# Altium schematic sheet BMS AFE - Cell Balancing.SchDoc: Title
size B; Organization: Midnight Sun Solar Rayce Car Team; Address1: University of Waterloo; Address2: 200 University Ave W; Address3: Waterloo, ON, Canada; Address4: N2L 3E9; DocumentNumber: 4; SheetNumber: 4; SheetTotal: 7; Website: www.uwmidsun.com; ProjectName: ProjectName
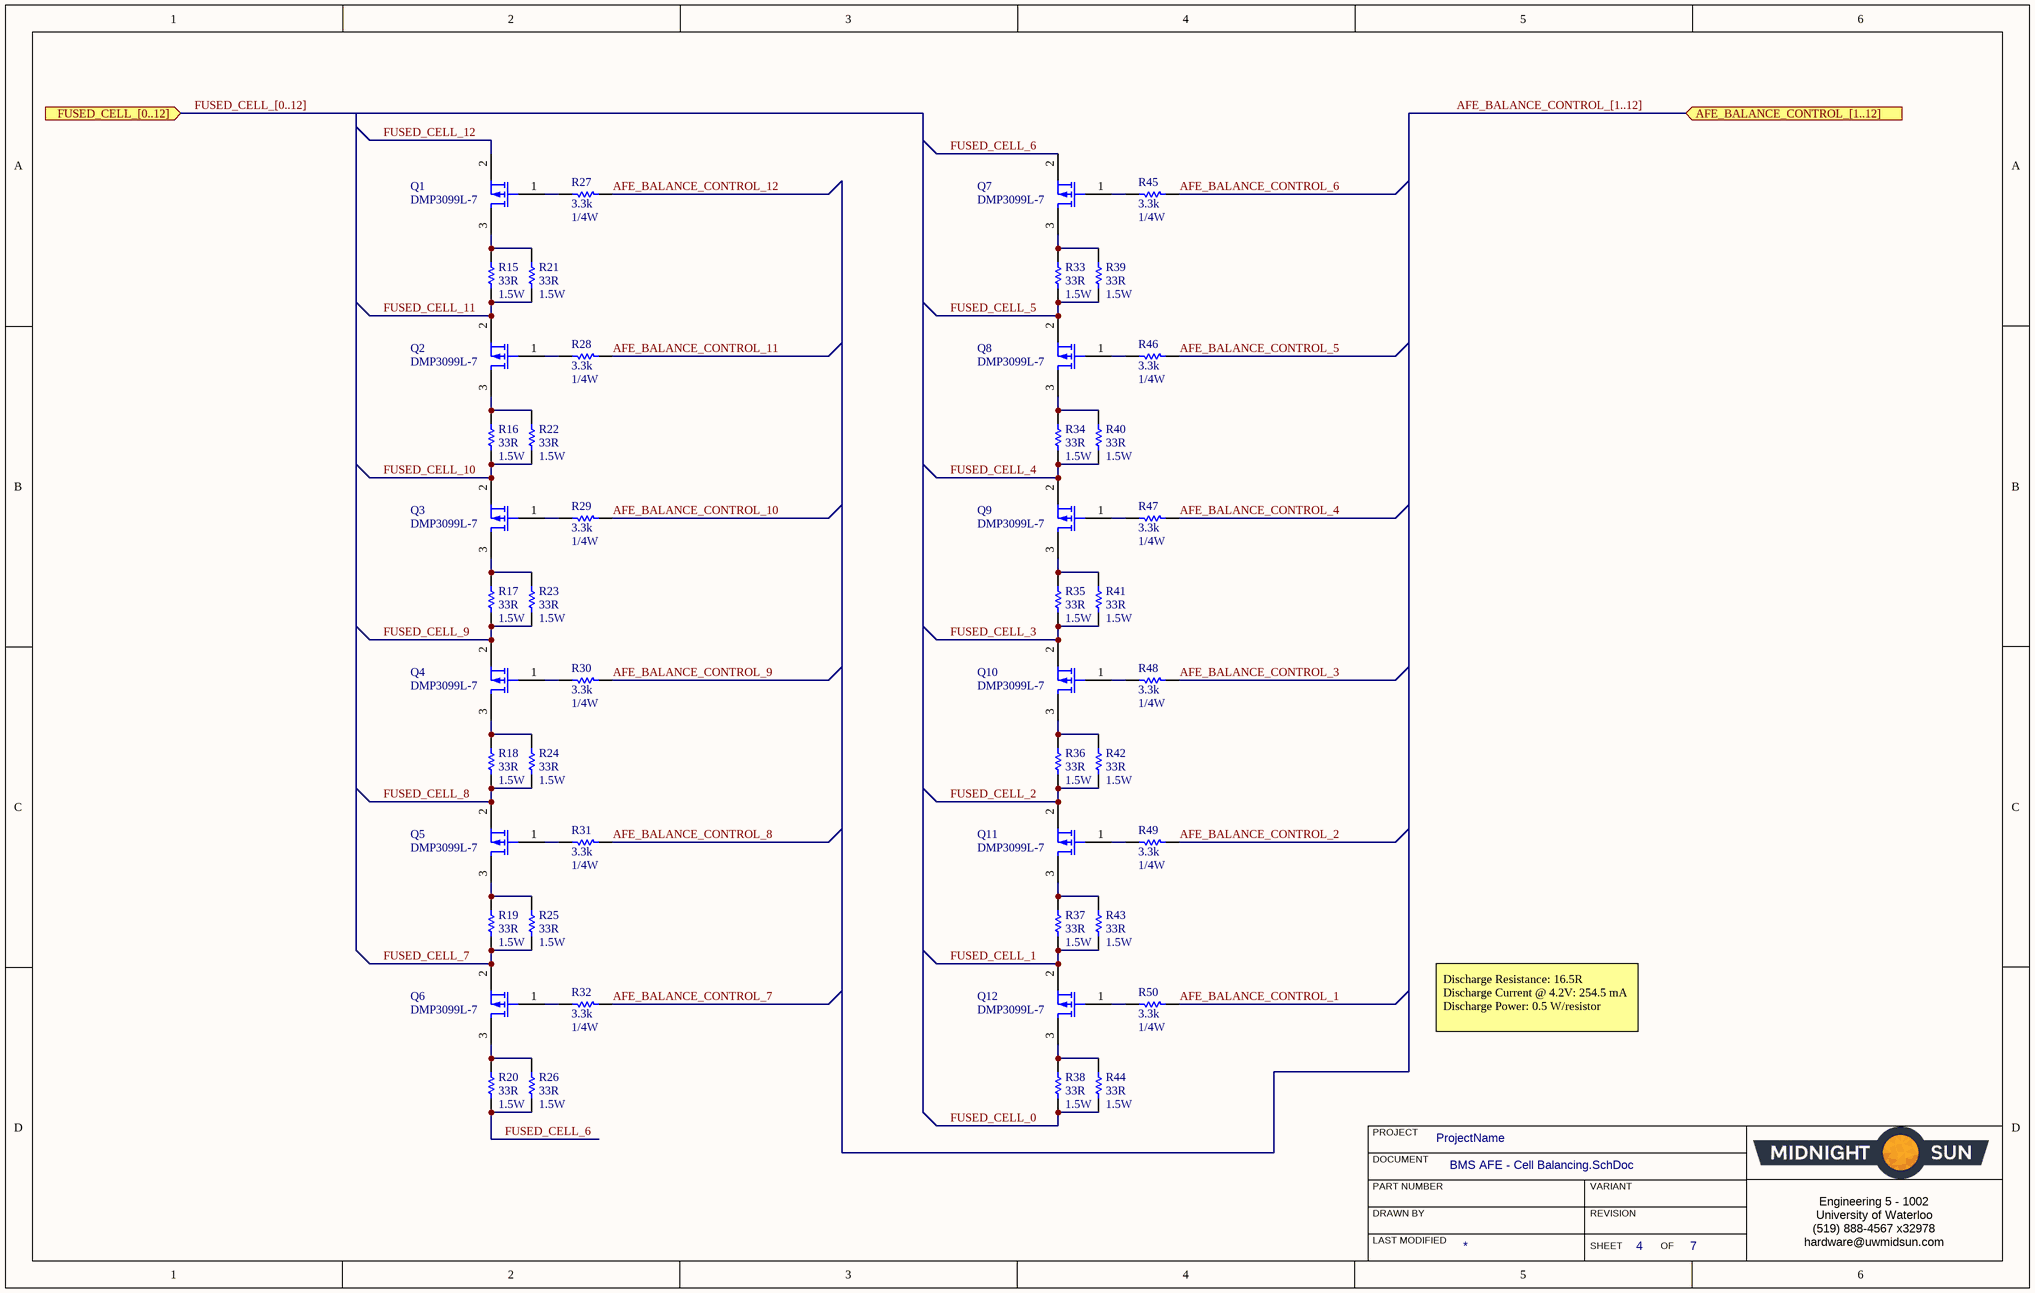
[diagram p0: BMS AFE - Cell Balancing.SchDoc]

## Parts
Q1  Manufacturer Part Number: DMP3099L-7  [MOSFET P-CH 30V 3.8A SOT-23]  (hidden comment: MOSFET P-CH 30V 3.8A SOT-23)
Q2  Manufacturer Part Number: DMP3099L-7  [MOSFET P-CH 30V 3.8A SOT-23]  (hidden comment: MOSFET P-CH 30V 3.8A SOT-23)
Q3  Manufacturer Part Number: DMP3099L-7  [MOSFET P-CH 30V 3.8A SOT-23]  (hidden comment: MOSFET P-CH 30V 3.8A SOT-23)
Q4  Manufacturer Part Number: DMP3099L-7  [MOSFET P-CH 30V 3.8A SOT-23]  (hidden comment: MOSFET P-CH 30V 3.8A SOT-23)
Q5  Manufacturer Part Number: DMP3099L-7  [MOSFET P-CH 30V 3.8A SOT-23]  (hidden comment: MOSFET P-CH 30V 3.8A SOT-23)
Q6  Manufacturer Part Number: DMP3099L-7  [MOSFET P-CH 30V 3.8A SOT-23]  (hidden comment: MOSFET P-CH 30V 3.8A SOT-23)
Q7  Manufacturer Part Number: DMP3099L-7  [MOSFET P-CH 30V 3.8A SOT-23]  (hidden comment: MOSFET P-CH 30V 3.8A SOT-23)
Q8  Manufacturer Part Number: DMP3099L-7  [MOSFET P-CH 30V 3.8A SOT-23]  (hidden comment: MOSFET P-CH 30V 3.8A SOT-23)
Q9  Manufacturer Part Number: DMP3099L-7  [MOSFET P-CH 30V 3.8A SOT-23]  (hidden comment: MOSFET P-CH 30V 3.8A SOT-23)
Q10  Manufacturer Part Number: DMP3099L-7  [MOSFET P-CH 30V 3.8A SOT-23]  (hidden comment: MOSFET P-CH 30V 3.8A SOT-23)
Q11  Manufacturer Part Number: DMP3099L-7  [MOSFET P-CH 30V 3.8A SOT-23]  (hidden comment: MOSFET P-CH 30V 3.8A SOT-23)
Q12  Manufacturer Part Number: DMP3099L-7  [MOSFET P-CH 30V 3.8A SOT-23]  (hidden comment: MOSFET P-CH 30V 3.8A SOT-23)
R15  value 33R  Power (Watts): 1.5W  [RES STACKPOLE RPC2512 2512]  (hidden comment: RES 33 OHM 5% 1.5W 2512)
R16  value 33R  Power (Watts): 1.5W  [RES STACKPOLE RPC2512 2512]  (hidden comment: RES 33 OHM 5% 1.5W 2512)
R17  value 33R  Power (Watts): 1.5W  [RES STACKPOLE RPC2512 2512]  (hidden comment: RES 33 OHM 5% 1.5W 2512)
R18  value 33R  Power (Watts): 1.5W  [RES STACKPOLE RPC2512 2512]  (hidden comment: RES 33 OHM 5% 1.5W 2512)
R19  value 33R  Power (Watts): 1.5W  [RES STACKPOLE RPC2512 2512]  (hidden comment: RES 33 OHM 5% 1.5W 2512)
R20  value 33R  Power (Watts): 1.5W  [RES STACKPOLE RPC2512 2512]  (hidden comment: RES 33 OHM 5% 1.5W 2512)
R21  value 33R  Power (Watts): 1.5W  [RES STACKPOLE RPC2512 2512]  (hidden comment: RES 33 OHM 5% 1.5W 2512)
R22  value 33R  Power (Watts): 1.5W  [RES STACKPOLE RPC2512 2512]  (hidden comment: RES 33 OHM 5% 1.5W 2512)
R23  value 33R  Power (Watts): 1.5W  [RES STACKPOLE RPC2512 2512]  (hidden comment: RES 33 OHM 5% 1.5W 2512)
R24  value 33R  Power (Watts): 1.5W  [RES STACKPOLE RPC2512 2512]  (hidden comment: RES 33 OHM 5% 1.5W 2512)
R25  value 33R  Power (Watts): 1.5W  [RES STACKPOLE RPC2512 2512]  (hidden comment: RES 33 OHM 5% 1.5W 2512)
R26  value 33R  Power (Watts): 1.5W  [RES STACKPOLE RPC2512 2512]  (hidden comment: RES 33 OHM 5% 1.5W 2512)
R27  Resistance: 3.3k  Power: 1/4W  [RES, 0603]  (hidden comment: RES 3.3K OHM 1% 1/4W 0603)
R28  Resistance: 3.3k  Power: 1/4W  [RES, 0603]  (hidden comment: RES 3.3K OHM 1% 1/4W 0603)
R29  Resistance: 3.3k  Power: 1/4W  [RES, 0603]  (hidden comment: RES 3.3K OHM 1% 1/4W 0603)
R30  Resistance: 3.3k  Power: 1/4W  [RES, 0603]  (hidden comment: RES 3.3K OHM 1% 1/4W 0603)
R31  Resistance: 3.3k  Power: 1/4W  [RES, 0603]  (hidden comment: RES 3.3K OHM 1% 1/4W 0603)
R32  Resistance: 3.3k  Power: 1/4W  [RES, 0603]  (hidden comment: RES 3.3K OHM 1% 1/4W 0603)
R33  value 33R  Power (Watts): 1.5W  [RES STACKPOLE RPC2512 2512]  (hidden comment: RES 33 OHM 5% 1.5W 2512)
R34  value 33R  Power (Watts): 1.5W  [RES STACKPOLE RPC2512 2512]  (hidden comment: RES 33 OHM 5% 1.5W 2512)
R35  value 33R  Power (Watts): 1.5W  [RES STACKPOLE RPC2512 2512]  (hidden comment: RES 33 OHM 5% 1.5W 2512)
R36  value 33R  Power (Watts): 1.5W  [RES STACKPOLE RPC2512 2512]  (hidden comment: RES 33 OHM 5% 1.5W 2512)
R37  value 33R  Power (Watts): 1.5W  [RES STACKPOLE RPC2512 2512]  (hidden comment: RES 33 OHM 5% 1.5W 2512)
R38  value 33R  Power (Watts): 1.5W  [RES STACKPOLE RPC2512 2512]  (hidden comment: RES 33 OHM 5% 1.5W 2512)
R39  value 33R  Power (Watts): 1.5W  [RES STACKPOLE RPC2512 2512]  (hidden comment: RES 33 OHM 5% 1.5W 2512)
R40  value 33R  Power (Watts): 1.5W  [RES STACKPOLE RPC2512 2512]  (hidden comment: RES 33 OHM 5% 1.5W 2512)
R41  value 33R  Power (Watts): 1.5W  [RES STACKPOLE RPC2512 2512]  (hidden comment: RES 33 OHM 5% 1.5W 2512)
R42  value 33R  Power (Watts): 1.5W  [RES STACKPOLE RPC2512 2512]  (hidden comment: RES 33 OHM 5% 1.5W 2512)
R43  value 33R  Power (Watts): 1.5W  [RES STACKPOLE RPC2512 2512]  (hidden comment: RES 33 OHM 5% 1.5W 2512)
R44  value 33R  Power (Watts): 1.5W  [RES STACKPOLE RPC2512 2512]  (hidden comment: RES 33 OHM 5% 1.5W 2512)
R45  Resistance: 3.3k  Power: 1/4W  [RES, 0603]  (hidden comment: RES 3.3K OHM 1% 1/4W 0603)
R46  Resistance: 3.3k  Power: 1/4W  [RES, 0603]  (hidden comment: RES 3.3K OHM 1% 1/4W 0603)
R47  Resistance: 3.3k  Power: 1/4W  [RES, 0603]  (hidden comment: RES 3.3K OHM 1% 1/4W 0603)
R48  Resistance: 3.3k  Power: 1/4W  [RES, 0603]  (hidden comment: RES 3.3K OHM 1% 1/4W 0603)
R49  Resistance: 3.3k  Power: 1/4W  [RES, 0603]  (hidden comment: RES 3.3K OHM 1% 1/4W 0603)
R50  Resistance: 3.3k  Power: 1/4W  [RES, 0603]  (hidden comment: RES 3.3K OHM 1% 1/4W 0603)

## Ports
AFE_BALANCE_CONTROL_[1..12] (in), FUSED_CELL_[0..12] (in)

## Nets
AFE_BALANCE_CONTROL_1: R50.1
AFE_BALANCE_CONTROL_2: R49.1
AFE_BALANCE_CONTROL_3: R48.1
AFE_BALANCE_CONTROL_4: R47.1
AFE_BALANCE_CONTROL_5: R46.1
AFE_BALANCE_CONTROL_6: R45.1
AFE_BALANCE_CONTROL_7: R32.1
AFE_BALANCE_CONTROL_8: R31.1
AFE_BALANCE_CONTROL_9: R30.1
AFE_BALANCE_CONTROL_10: R29.1
AFE_BALANCE_CONTROL_11: R28.1
AFE_BALANCE_CONTROL_12: R27.1
FUSED_CELL_0: R38.2 R44.2
FUSED_CELL_1: Q12.2(S) R37.2 R43.2
FUSED_CELL_2: Q11.2(S) R36.2 R42.2
FUSED_CELL_3: Q10.2(S) R35.2 R41.2
FUSED_CELL_4: Q9.2(S) R34.2 R40.2
FUSED_CELL_5: Q8.2(S) R33.2 R39.2
FUSED_CELL_6: Q7.2(S) R20.2 R26.2
FUSED_CELL_7: Q6.2(S) R19.2 R25.2
FUSED_CELL_8: Q5.2(S) R18.2 R24.2
FUSED_CELL_9: Q4.2(S) R17.2 R23.2
FUSED_CELL_10: Q3.2(S) R16.2 R22.2
FUSED_CELL_11: Q2.2(S) R15.2 R21.2
FUSED_CELL_12: Q1.2(S)
NetQ1_1: Q1.1(G) R27.2
NetQ1_3: Q1.3(D) R15.1 R21.1
NetQ2_1: Q2.1(G) R28.2
NetQ2_3: Q2.3(D) R16.1 R22.1
NetQ3_1: Q3.1(G) R29.2
NetQ3_3: Q3.3(D) R17.1 R23.1
NetQ4_1: Q4.1(G) R30.2
NetQ4_3: Q4.3(D) R18.1 R24.1
NetQ5_1: Q5.1(G) R31.2
NetQ5_3: Q5.3(D) R19.1 R25.1
NetQ6_1: Q6.1(G) R32.2
NetQ6_3: Q6.3(D) R20.1 R26.1
NetQ7_1: Q7.1(G) R45.2
NetQ7_3: Q7.3(D) R33.1 R39.1
NetQ8_1: Q8.1(G) R46.2
NetQ8_3: Q8.3(D) R34.1 R40.1
NetQ9_1: Q9.1(G) R47.2
NetQ9_3: Q9.3(D) R35.1 R41.1
NetQ10_1: Q10.1(G) R48.2
NetQ10_3: Q10.3(D) R36.1 R42.1
NetQ11_1: Q11.1(G) R49.2
NetQ11_3: Q11.3(D) R37.1 R43.1
NetQ12_1: Q12.1(G) R50.2
NetQ12_3: Q12.3(D) R38.1 R44.1

## Buses and harness runs
bus AFE_BALANCE_CONTROL_[1..12] = port AFE_BALANCE_CONTROL_[1..12]
bus FUSED_CELL_[0..12] = port FUSED_CELL_[0..12]

## Notes on the sheet
- Discharge Resistance: 16.5R
  Discharge Current @ 4.2V: 254.5 mA
  Discharge Power: 0.5 W/resistor
- PROJECT
- DOCUMENT
- DRAWN BY
- LAST MODIFIED
- PART NUMBER
- REVISION
- SHEET
- VARIANT
- OF
- Engineering 5 - 1002
  University of Waterloo
  (519) 888-4567 x32978
  hardware@uwmidsun.com

## Library data of the parts
Q1-Q12 = MOSFET P-CH 30V 3.8A SOT-23: P-Channel 30V 3.8A (Ta) 1.08W (Ta) Surface Mount SOT-23; Manufacturer: Diodes Incorporated; Drive Voltage (Max Rds On,  Min Rds On): 4.5V, 10V; Rds On (Max) @ Id, Vgs: 65 mOhm @ 3.8A, 10V; Vgs(th) (Max) @ Id: 2.1V @ 250µA; Vgs (Max): ±20V; Supplier 1: Digi-Key; RoHS: RoHS Compliant; Category: Discrete Semiconductor Products; Stock 1: 108364; Pricing 1: 1=0.59, 10=0.429, 100=0.2522, 500=0.14282, 1000=0.10949 (CAD); Packaging: Cut Tape (CT); Part Status: Active; FET Type: P-Channel; Technology: MOSFET (Metal Oxide); Current - Continuous Drain (Id) @ 25°C: 3.8A (Ta); FET Feature: -; Power Dissipation (Max): 1.08W (Ta); Operating Temperature: -55°C ~ 150°C (TJ); Mounting Type: Surface Mount; Supplier Device Package: SOT-23; Package / Case: TO-236-3, SC-59, SOT-23-3; ComponentLink1URL: https://www.diodes.com/assets/Datasheets/DMP3099L.pdf; ComponentLink1Description: https://www.diodes.com/assets/Datasheets/DMP3099L.pdf; Supplier Part Number 1: DMP3099L-7DICT-ND
R15-R26 R33-R44 = RES 33 OHM 5% 1.5W 2512: 33 Ohms ±5% 1.5W Chip Resistor 2512 (6432 Metric) Automotive AEC-Q200, Pulse Withstanding Thick Film; Manufacturer: Stackpole Electronics Inc.; Manufacturer Part Number: RPC2512JT33R0; Temperature Coefficient: ±100ppm/°C; Supplier 1: Digi-Key; RoHS: RoHS Compliant; Category: Resistors; Stock 1: 28556; Pricing 1: 1=0.88, 10=0.632, 100=0.3284, 1000=0.17685 (CAD); Packaging: Cut Tape (CT); Part Status: Active; Composition: Thick Film; Features: Automotive AEC-Q200, Pulse Withstanding; Operating Temperature: -55°C ~ 155°C; Package / Case: 2512 (6432 Metric); Supplier Device Package: 2512; Size / Dimension: 0.250" L x 0.122" W (6.35mm x 3.10mm); Height - Seated (Max): 0.026" (0.65mm); Failure Rate: -; ComponentLink1URL: https://www.seielect.com/Catalog/SEI-rpc.pdf; ComponentLink1Description: https://www.seielect.com/Catalog/SEI-rpc.pdf; Supplier Part Number 1: RPC2512JT33R0CT-ND; Tolerance: ±5%
R27-R32 R45-R50 = RES 3.3K OHM 1% 1/4W 0603: 3.3k Ohm ±1% 0.25W, 1/4W Chip Resistor 0603 (1608 Metric) Automotive AEC-Q200, Pulse Withstanding Thick Film; Manufacturer 1: Panasonic Electronic Components; Manufacturer Part Number 1: ERJ-PA3F3301V; Temperature Coefficient: ±100ppm/°C; Supplier 1: Digi-Key; Supplier Part Number 1: P3.3KBYCT-ND; Packaging: Cut Tape (CT); Part Status: Active; Composition: Thick Film; Operating Temperature: -55°C ~ 155°C; Package / Case: 0603 (1608 Metric); Supplier Device Package: 0603; Size / Dimension: 0.063" L x 0.031" W (1.60mm x 0.80mm); Height - Seated (Max): 0.022" (0.55mm); Failure Rate: -; ComponentLink1URL: https://industrial.panasonic.com/cdbs/www-data/pdf/RDO0000/AOA0000C291.pdf; ComponentLink1Description: https://industrial.panasonic.com/cdbs/www-data/pdf/RDO0000/AOA0000C291.pdf; Tolerance: ±1%